# EAGLE design knitRider_T_1_4_redukce led (EAGLE 9.0.0)
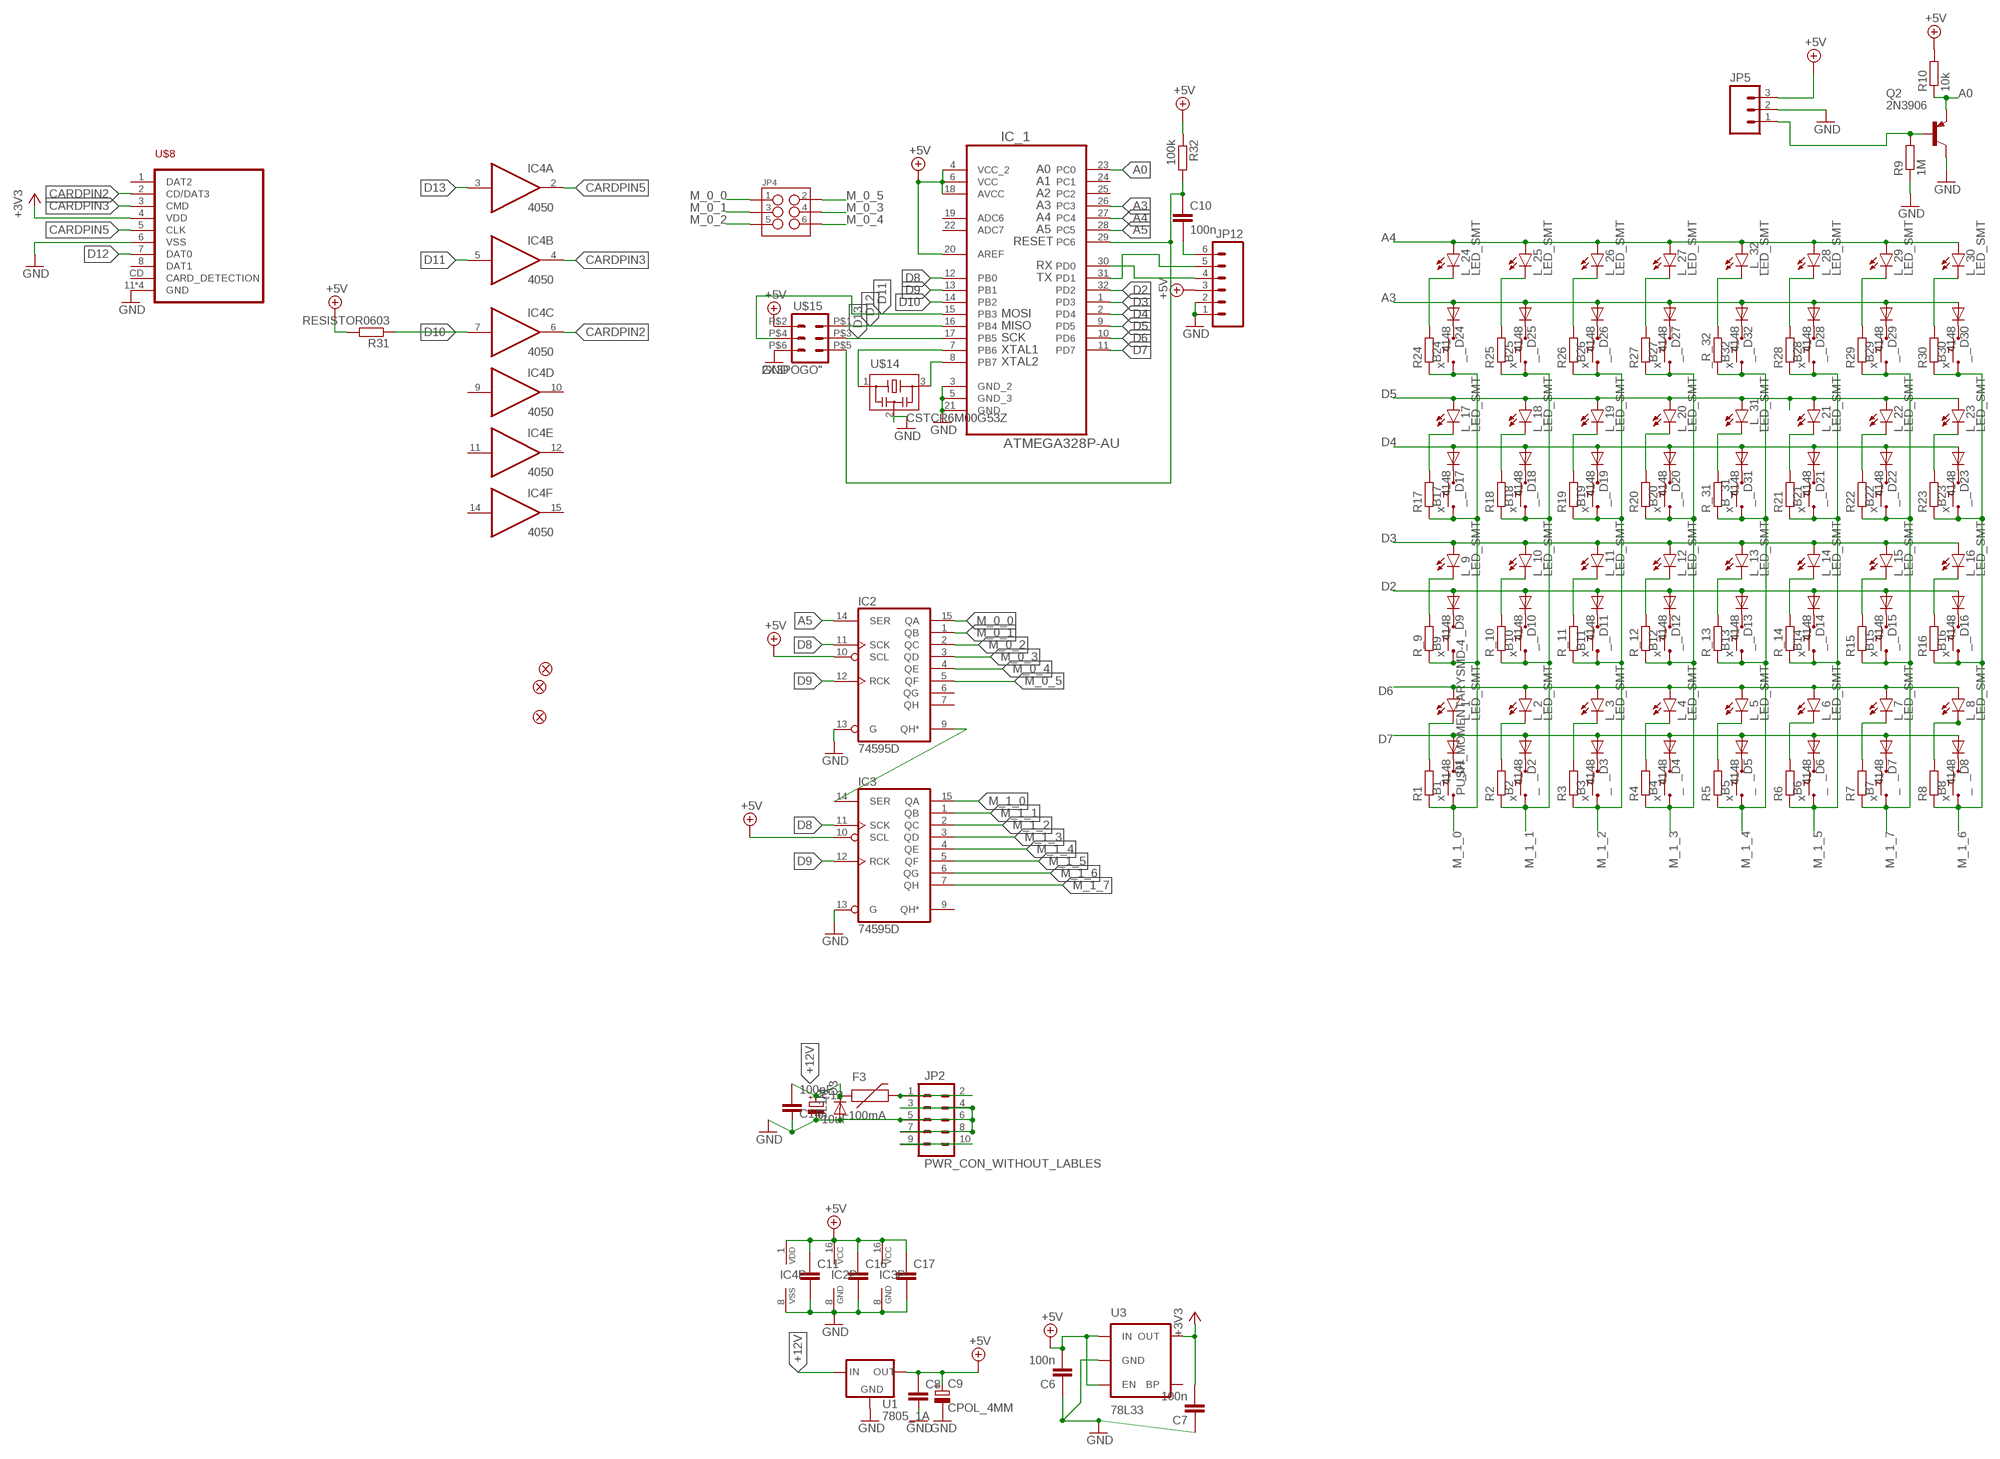
[diagram p0: schematic, sheet 1]

## Parts
_D1  4148  1N4148_0603  [DIODE_0603]
_D2  4148  1N4148_0603  [DIODE_0603]
_D3  4148  1N4148_0603  [DIODE_0603]
_D4  4148  1N4148_0603  [DIODE_0603]
_D5  4148  1N4148_0603  [DIODE_0603]
_D6  4148  1N4148_0603  [DIODE_0603]
_D7  4148  1N4148_0603  [DIODE_0603]
_D8  4148  1N4148_0603  [DIODE_0603]
_D9  4148  1N4148_0603  [DIODE_0603]
_D10  4148  1N4148_0603  [DIODE_0603]
_D11  4148  1N4148_0603  [DIODE_0603]
_D12  4148  1N4148_0603  [DIODE_0603]
_D13  4148  1N4148_0603  [DIODE_0603]
_D14  4148  1N4148_0603  [DIODE_0603]
_D15  4148  1N4148_0603  [DIODE_0603]
_D16  4148  1N4148_0603  [DIODE_0603]
_D17  4148  1N4148_0603  [DIODE_0603]
_D18  4148  1N4148_0603  [DIODE_0603]
_D19  4148  1N4148_0603  [DIODE_0603]
_D20  4148  1N4148_0603  [DIODE_0603]
_D21  4148  1N4148_0603  [DIODE_0603]
_D22  4148  1N4148_0603  [DIODE_0603]
_D23  4148  1N4148_0603  [DIODE_0603]
_D24  4148  1N4148_0603  [DIODE_0603]
_D25  4148  1N4148_0603  [DIODE_0603]
_D26  4148  1N4148_0603  [DIODE_0603]
_D27  4148  1N4148_0603  [DIODE_0603]
_D28  4148  1N4148_0603  [DIODE_0603]
_D29  4148  1N4148_0603  [DIODE_0603]
_D30  4148  1N4148_0603  [DIODE_0603]
_D31  4148  1N4148_0603  [DIODE_0603]
_D32  4148  1N4148_0603  [DIODE_0603]
_L_31  LED_SMT  [LED_0603]
_L_32  LED_SMT  [LED_0603]
_R_32  x  RESISTOR0603  [RESISTOR0603]
B1  PUSH_MOMENTARYSMD-4  [TACTILE_SWITCH_TALL]
B2  _  PUSH_MOMENTARYSMD-4  [TACTILE_SWITCH_TALL]
B3  _  PUSH_MOMENTARYSMD-4  [TACTILE_SWITCH_TALL]
B4  _  PUSH_MOMENTARYSMD-4  [TACTILE_SWITCH_TALL]
B5  _  PUSH_MOMENTARYSMD-4  [TACTILE_SWITCH_TALL]
B6  _  PUSH_MOMENTARYSMD-4  [TACTILE_SWITCH_TALL]
B7  _  PUSH_MOMENTARYSMD-4  [TACTILE_SWITCH_TALL]
B8  _  PUSH_MOMENTARYSMD-4  [TACTILE_SWITCH_TALL]
B9  _  PUSH_MOMENTARYSMD-4  [TACTILE_SWITCH_TALL]
B10  _  PUSH_MOMENTARYSMD-4  [TACTILE_SWITCH_TALL]
B11  _  PUSH_MOMENTARYSMD-4  [TACTILE_SWITCH_TALL]
B12  _  PUSH_MOMENTARYSMD-4  [TACTILE_SWITCH_TALL]
B13  _  PUSH_MOMENTARYSMD-4  [TACTILE_SWITCH_TALL]
B14  _  PUSH_MOMENTARYSMD-4  [TACTILE_SWITCH_TALL]
B15  _  PUSH_MOMENTARYSMD-4  [TACTILE_SWITCH_TALL]
B16  _  PUSH_MOMENTARYSMD-4  [TACTILE_SWITCH_TALL]
B17  _  PUSH_MOMENTARYSMD-4  [TACTILE_SWITCH_TALL]
B18  _  PUSH_MOMENTARYSMD-4  [TACTILE_SWITCH_TALL]
B19  _  PUSH_MOMENTARYSMD-4  [TACTILE_SWITCH_TALL]
B20  _  PUSH_MOMENTARYSMD-4  [TACTILE_SWITCH_TALL]
B21  _  PUSH_MOMENTARYSMD-4  [TACTILE_SWITCH_TALL]
B22  _  PUSH_MOMENTARYSMD-4  [TACTILE_SWITCH_TALL]
B23  _  PUSH_MOMENTARYSMD-4  [TACTILE_SWITCH_TALL]
B24  _  PUSH_MOMENTARYSMD-4  [TACTILE_SWITCH_TALL]
B25  _  PUSH_MOMENTARYSMD-4  [TACTILE_SWITCH_TALL]
B26  _  PUSH_MOMENTARYSMD-4  [TACTILE_SWITCH_TALL]
B27  _  PUSH_MOMENTARYSMD-4  [TACTILE_SWITCH_TALL]
B28  _  PUSH_MOMENTARYSMD-4  [TACTILE_SWITCH_TALL]
B29  _  PUSH_MOMENTARYSMD-4  [TACTILE_SWITCH_TALL]
B30  _  PUSH_MOMENTARYSMD-4  [TACTILE_SWITCH_TALL]
B32  _  PUSH_MOMENTARYSMD-4  [TACTILE_SWITCH_TALL]
B_31  _  PUSH_MOMENTARYSMD-4  [TACTILE_SWITCH_TALL]
C6  100n  CAPACITOR0603  [CAPACITOR0603]
C7  100n  CAPACITOR0603  [CAPACITOR0603]
C8  CAPACITOR0603  [CAPACITOR0603]
C9  CPOL_4MM  [CPOL_4MM]
C10  100n  CAPACITOR0603  [CAPACITOR0603]
C11  CAPACITOR0603  [CAPACITOR0603]
C12  10uF  CPOL_4MM  [CPOL_4MM]
C14  100nF  CAPACITOR0603  [CAPACITOR0603]
C16  CAPACITOR0603  [CAPACITOR0603]
C17  CAPACITOR0603  [CAPACITOR0603]
D3  SL1M  [SOD123]
F3  100mA  PTC_0805  [PTC0805]
FID1  FIDUCIAL  [FIDUCIAL]
FID2  FIDUCIAL  [FIDUCIAL]
FID3  FIDUCIAL  [FIDUCIAL]
IC2  74595D  [SO16]
IC3  74595D  [SO16]
IC4  4050  [SO16]
IC_1  ATMEGA328P-AU  [TQFP32]
JP2  PWR_CON_WITHOUT_LABLES  [PWR_CON_WITHOUT_LABLES]
JP4  M03X2NO_SILK  [2X3-NS]
JP5  M03LOCK  [1X03_LOCK]
JP12  M06LOCK  [1X06_LOCK]
L_1  LED_SMT  [LED_0603]
L_2  LED_SMT  [LED_0603]
L_3  LED_SMT  [LED_0603]
L_4  LED_SMT  [LED_0603]
L_5  LED_SMT  [LED_0603]
L_6  LED_SMT  [LED_0603]
L_7  LED_SMT  [LED_0603]
L_8  LED_SMT  [LED_0603]
L_9  LED_SMT  [LED_0603]
L_10  LED_SMT  [LED_0603]
L_11  LED_SMT  [LED_0603]
L_12  LED_SMT  [LED_0603]
L_13  LED_SMT  [LED_0603]
L_14  LED_SMT  [LED_0603]
L_15  LED_SMT  [LED_0603]
L_16  LED_SMT  [LED_0603]
L_17  LED_SMT  [LED_0603]
L_18  LED_SMT  [LED_0603]
L_19  LED_SMT  [LED_0603]
L_20  LED_SMT  [LED_0603]
L_21  LED_SMT  [LED_0603]
L_22  LED_SMT  [LED_0603]
L_23  LED_SMT  [LED_0603]
L_24  LED_SMT  [LED_0603]
L_25  LED_SMT  [LED_0603]
L_26  LED_SMT  [LED_0603]
L_27  LED_SMT  [LED_0603]
L_28  LED_SMT  [LED_0603]
L_29  LED_SMT  [LED_0603]
L_30  LED_SMT  [LED_0603]
Q2  2N3906  [SOT23]
R1  x  RESISTOR0603  [RESISTOR0603]
R2  x  RESISTOR0603  [RESISTOR0603]
R3  x  RESISTOR0603  [RESISTOR0603]
R4  x  RESISTOR0603  [RESISTOR0603]
R5  x  RESISTOR0603  [RESISTOR0603]
R6  x  RESISTOR0603  [RESISTOR0603]
R7  x  RESISTOR0603  [RESISTOR0603]
R8  x  RESISTOR0603  [RESISTOR0603]
R9  1M  RESISTOR0603  [RESISTOR0603]
R10  10k  RESISTOR0603  [RESISTOR0603]
R15  x  RESISTOR0603  [RESISTOR0603]
R16  x  RESISTOR0603  [RESISTOR0603]
R17  x  RESISTOR0603  [RESISTOR0603]
R18  x  RESISTOR0603  [RESISTOR0603]
R19  x  RESISTOR0603  [RESISTOR0603]
R20  x  RESISTOR0603  [RESISTOR0603]
R21  x  RESISTOR0603  [RESISTOR0603]
R22  x  RESISTOR0603  [RESISTOR0603]
R23  x  RESISTOR0603  [RESISTOR0603]
R24  x  RESISTOR0603  [RESISTOR0603]
R25  x  RESISTOR0603  [RESISTOR0603]
R26  x  RESISTOR0603  [RESISTOR0603]
R27  x  RESISTOR0603  [RESISTOR0603]
R28  x  RESISTOR0603  [RESISTOR0603]
R29  x  RESISTOR0603  [RESISTOR0603]
R30  x  RESISTOR0603  [RESISTOR0603]
R31  RESISTOR0603  [RESISTOR0603]
R32  100k  RESISTOR0603  [RESISTOR0603]
R_9  x  RESISTOR0603  [RESISTOR0603]
R_10  x  RESISTOR0603  [RESISTOR0603]
R_11  x  RESISTOR0603  [RESISTOR0603]
R_12  x  RESISTOR0603  [RESISTOR0603]
R_13  x  RESISTOR0603  [RESISTOR0603]
R_14  x  RESISTOR0603  [RESISTOR0603]
R_31  x  RESISTOR0603  [RESISTOR0603]
U1  7805_1A  [DPAK]
U3  78L33  V_REG_LDOSMD  [SOT23-5]
U$8  SD_CARD_SLOT  [MICRO_SD_CARD_SLOT]
U$14  CSTCR6M00G53Z  [CSTCR6M]
U$15  2X3POGO"  [2X3_POGO]

## Nets
+3V3: C7.2 U3.5(OUT) U$8.4(VDD)
+5V: C6.2 C8.1 C9.+ C11.1 C16.1 C17.1 IC2.10(SCL) IC2.16(VCC) IC3.10(SCL) IC3.16(VCC) IC4.1(P:VDD) IC_1.4(VCC_2) IC_1.6(VCC) IC_1.18(AVCC) IC_1.20(AREF) JP5.3 JP12.3 R10.2 R31.2 R32.1 U1.3(OUT) U3.1(IN) U3.3(EN) U$15.P$2
+12V: C12.+ C14.2 D3.C F3.2 U1.1(IN)
_L32: _L_32.K(C) _R_32.2
A0: IC_1.23(PC0) Q2.E R10.1
A3: _D24.A _D25.A _D26.A _D27.A _D28.A _D29.A _D30.A _D32.A IC_1.26(PC3)
A4: _L_32.A IC_1.27(PC4) L_24.A L_25.A L_26.A L_27.A L_28.A L_29.A L_30.A
A5: IC2.14(SER) IC_1.28(PC5)
CARDPIN2: IC4.6(C:O) U$8.2(CD/DAT3)
CARDPIN3: IC4.4(B:O) U$8.3(CMD)
CARDPIN5: IC4.2(A:O) U$8.5(CLK)
D2: _D9.A _D10.A _D11.A _D12.A _D13.A _D14.A _D15.A _D16.A IC_1.32(PD2)
D3: IC_1.1(PD3) L_9.A L_10.A L_11.A L_12.A L_13.A L_14.A L_15.A L_16.A
D4: _D17.A _D18.A _D19.A _D20.A _D21.A _D22.A _D23.A _D31.A IC_1.2(PD4)
D5: _L_31.A IC_1.9(PD5) L_17.A L_18.A L_19.A L_20.A L_21.A L_22.A L_23.A
D6: IC_1.10(PD6) L_1.A L_2.A L_3.A L_4.A L_5.A L_6.A L_7.A L_8.A
D7: _D1.A _D2.A _D3.A _D4.A _D5.A _D6.A _D7.A _D8.A IC_1.11(PD7)
D8: IC2.11(SCK) IC3.11(SCK) IC_1.12(PB0)
D9: IC2.12(RCK) IC3.12(RCK) IC_1.13(PB1)
D10: IC4.7(C:I) IC_1.14(PB2) R31.1
D11: IC4.5(B:I) IC_1.15(PB3) U$15.P$4
D12: IC_1.16(PB4) U$8.7(DAT0) U$15.P$1
D13: IC4.3(A:I) IC_1.17(PB5) U$15.P$3
GND: C6.1 C7.1 C8.2 C9.- C11.2 C12.- C14.1 C16.2 C17.2 D3.A IC2.8(GND) IC2.13(G) IC3.8(GND) IC3.13(G) IC4.8(P:VSS) IC_1.3(GND_2) IC_1.5(GND_3) IC_1.21(GND) JP2.3 JP2.4 JP2.5 JP2.6 JP2.7 JP2.8 JP5.2 JP12.1 JP12.2 Q2.C R9.1 U1.4(GND) U3.2(GND) U$8.6(VSS) U$8.11(GND) U$8.12(GND) U$8.13(GND) U$8.G(GND) U$14.2 U$15.P$6
L32: _L_31.K(C) R_31.2
M_0_0: IC2.15(QA) JP4.1
M_0_1: IC2.1(QB) JP4.3
M_0_2: IC2.2(QC) JP4.5
M_0_3: IC2.3(QD) JP4.4
M_0_4: IC2.4(QE) JP4.6
M_0_5: IC2.5(QF) JP4.2
M_1_0: B1.A1 B1.A2 B9.A1 B9.A2 B17.A1 B17.A2 B24.A1 B24.A2 IC3.15(QA) R1.1 R17.1 R24.1 R_9.1
M_1_1: B2.A1 B2.A2 B10.A1 B10.A2 B18.A1 B18.A2 B25.A1 B25.A2 IC3.1(QB) R2.1 R18.1 R25.1 R_10.1
M_1_2: B3.A1 B3.A2 B11.A1 B11.A2 B19.A1 B19.A2 B26.A1 B26.A2 IC3.2(QC) R3.1 R19.1 R26.1 R_11.1
M_1_3: B4.A1 B4.A2 B12.A1 B12.A2 B20.A1 B20.A2 B27.A1 B27.A2 IC3.3(QD) R4.1 R20.1 R27.1 R_12.1
M_1_4: _R_32.1 B5.A1 B5.A2 B13.A1 B13.A2 B32.A1 B32.A2 B_31.A1 B_31.A2 IC3.4(QE) R5.1 R_13.1 R_31.1
M_1_5: B6.A1 B6.A2 B14.A1 B14.A2 B21.A1 B21.A2 B28.A1 B28.A2 IC3.5(QF) R6.1 R21.1 R28.1 R_14.1
M_1_6: B8.A1 B8.A2 B16.A1 B16.A2 B23.A1 B23.A2 B30.A1 B30.A2 IC3.6(QG) R8.1 R16.1 R23.1 R30.1
M_1_7: B7.A1 B7.A2 B15.A1 B15.A2 B22.A1 B22.A2 B29.A1 B29.A2 IC3.7(QH) R7.1 R15.1 R22.1 R29.1
N$1: _D1.K(C) B1.B1 B1.B2
N$2: _D2.K(C) B2.B1 B2.B2
N$3: _D3.K(C) B3.B1 B3.B2
N$4: JP5.1 Q2.B R9.2
N$5: _D4.K(C) B4.B1 B4.B2
N$8: _D5.K(C) B5.B1 B5.B2
N$9: _D6.K(C) B6.B1 B6.B2
N$10: L_3.K(C) R3.2
N$11: F3.3 JP2.1 JP2.2
N$12: _D9.K(C) B9.B1 B9.B2
N$13: _D10.K(C) B10.B1 B10.B2
N$14: _D7.K(C) B7.B1 B7.B2
N$15: _D8.K(C) B8.B1 B8.B2
N$16: JP2.9 JP2.10
N$17: _D11.K(C) B11.B1 B11.B2
N$21: L_4.K(C) R4.2
N$22: L_5.K(C) R5.2
N$23: L_6.K(C) R6.2
N$24: L_7.K(C) R7.2
N$25: _D12.K(C) B12.B1 B12.B2
N$26: L_8.K(C) R8.2
N$27: _D13.K(C) B13.B1 B13.B2
N$28: _D14.K(C) B14.B1 B14.B2
N$29: _D15.K(C) B15.B1 B15.B2
N$30: _D16.K(C) B16.B1 B16.B2
N$31: _D17.K(C) B17.B1 B17.B2
N$32: _D18.K(C) B18.B1 B18.B2
N$33: _D19.K(C) B19.B1 B19.B2
N$35: L_1.K(C) R1.2
N$36: L_2.K(C) R2.2
N$37: _D20.K(C) B20.B1 B20.B2
N$38: _D21.K(C) B21.B1 B21.B2
N$39: _D22.K(C) B22.B1 B22.B2
N$40: _D23.K(C) B23.B1 B23.B2
N$41: _D24.K(C) B24.B1 B24.B2
N$42: L_9.K(C) R_9.2
N$43: L_10.K(C) R_10.2
N$44: L_11.K(C) R_11.2
N$45: L_12.K(C) R_12.2
N$46: L_13.K(C) R_13.2
N$47: L_14.K(C) R_14.2
N$48: L_15.K(C) R15.2
N$51: L_16.K(C) R16.2
N$53: _D25.K(C) B25.B1 B25.B2
N$55: _D26.K(C) B26.B1 B26.B2
N$59: L_18.K(C) R18.2
N$60: L_19.K(C) R19.2
N$61: L_17.K(C) R17.2
N$62: L_20.K(C) R20.2
N$63: L_23.K(C) R23.2
N$64: L_22.K(C) R22.2
N$65: _D27.K(C) B27.B1 B27.B2
N$66: L_21.K(C) R21.2
N$68: _D28.K(C) B28.B1 B28.B2
N$69: _D29.K(C) B29.B1 B29.B2
N$70: _D30.K(C) B30.B1 B30.B2
N$71: _D31.K(C) B_31.B1 B_31.B2
N$72: _D32.K(C) B32.B1 B32.B2
N$80: IC2.9(QH*) IC3.14(SER)
N$82: L_24.K(C) R24.2
N$83: L_25.K(C) R25.2
N$84: L_26.K(C) R26.2
N$85: L_27.K(C) R27.2
N$86: L_28.K(C) R28.2
N$87: L_29.K(C) R29.2
N$88: L_30.K(C) R30.2
N$94: IC_1.7(PB6) U$14.1
N$95: IC_1.8(PB7) U$14.3
N$96: IC_1.30(PD0) JP12.4
N$97: IC_1.31(PD1) JP12.5
N$98: C10.1 IC_1.29(PC6) R32.2 U$15.P$5
N$99: C10.2 JP12.6
Unconnected: IC2.6(QG) IC2.7(QH) IC3.9(QH*) IC4.9(D:I) IC4.10(D:O) IC4.11(E:I) IC4.12(E:O) IC4.14(F:I) IC4.15(F:O) IC_1.19(ADC6) IC_1.22(ADC7) IC_1.24(PC1) IC_1.25(PC2) U3.4(BP) U$8.1(DAT2) U$8.8(DAT1) U$8.CD(CARD_DETECTION)

## Library data of the parts
_D1-_D32 = BASTL_DIODES:1N4148_0603; ASSEMBLED: yes; TYPE: SMT
_L_31 _L_32 L_1-L_30 = BASTL_LEDS:LED_SMT; ASSEMBLED: yes; TYPE: SMT
_R_32 R1-R10 R15-R32 R_9-R_14 R_31 = BASTL_RESISTORS:RESISTOR0603; ASSEMBLED: yes; TYPE: SMT
B1-B30 B32 B_31 = BASTL_SWITCHES:PUSH_MOMENTARY: Various NO switches- pushbuttons, reed, etc; ASSEMBLED: yes; PROD_ID: SWCH-11966; TYPE: SMT
C6-C8 C10 C11 C14 C16 C17 = BASTL_CAPACITORS:CAPACITOR0603; ASSEMBLED: yes; TYPE: SMT
C9 C12 = BASTL_CAPACITORS:CPOL_4MM; ASSEMBLED: yes; TYPE: SMT
D3 = BASTL_DIODES:SL1M: diode instead of 1N4007; ASSEMBLED: yes; MAN: DIOTEC SEMICONDUCTOR; MPN: SL1M; TYPE: SMT
F3 = BASTL_FUSES:PTC_0805
FID1-FID3 = BASTL_FIDUCIALS:FIDUCIAL; ASSEMBLED: no; TYPE: FID
IC2 IC3 = BASTL_ICS:74*595: 8-bit SHIFT REGISTER, output latch; ASSEMBLED: yes; MAN: Texas Instruments; MPN: SN74HC595DR; TYPE: SMT
IC4 = BASTL_ICS:4050: Hex non-inverting BUFFER; ASSEMBLED: yes; MAN: Texas Instruments; MPN: CD4050BDR; TYPE: SMT
IC_1 = BASTL_ICS:ATMEGA328P-AU: 8-bit Microcontroller with In-System Programmable Flash; ASSEMBLED: yes; MAN: Microchip; MPN: ATMEGA328P-AU; TYPE: SMT
JP2 = BASTL_CONNECTORS:PWR_CON_WITHOUT_LABLES; ASSEMBLED: yes; ODOO: Male 2x40; TYPE: THT
JP4 = BASTL_PINHEADERS:M03X2: 2x3 .1" header. Shrouded, with keying- CONN-10681 SMT- CONN-11415 Pogo pins- HW-11044
JP5 = BASTL_PINHEADERS:M03: Header 3 Standard 3-pin 0.1" header. Use with straight break away headers (SKU : PRT-00116), right angle break away headers (PRT-00553), swiss pins (PRT-00743), machine pins (PRT-00117), and female headers (PRT-00115). Molex polarized connector foot print use with SKU : PRT-08232 with associated crimp pins and housings.
JP12 = BASTL_PINHEADERS:M06: Header 6 Standard 6-pin 0.1" header. Use with straight break away headers (SKU : PRT-00116), right angle break away headers (PRT-00553), swiss pins (PRT-00743), machine pins (PRT-00117), and female headers (PRT-00115). Molex polarized connector foot print use with SKU : PRT-08094 with associated crimp pins and housings. NOTES ON THE VARIANTS LOCK and LOCK_LONGPADS... This footprint was designed to help hold the alignment of a through-hole component (i.e. 6-pin header) while soldering it into place. You may notice that each hole has been shifted either up or down by 0.005 of an inch from it's more standard position (which is a perfectly straight line). This slight alteration caused the pins (the squares in the middle) to touch the edges of the holes. Because they are alternating, it causes a "brace" to hold the component in place. 0.005 has proven to be the perfect amount of "off-center" position when using our standard breakaway headers. Although looks a little odd when you look at the bare footprint, once you have a header in there, the alteration is very hard to notice. Also,if you push a header all the way into place, it is covered up entirely on the bottom side. This idea of altering the position of holes to aid alignment will be further integrated into the Sparkfun Library for other footprints. It can help hold any component with 3 or more connection pins.
Q2 = BASTL_TRANZISTORS:2N3906; ASSEMBLED: yes; MAN: ON SEMICONDUCTOR; MPN: MMBT3906LT1G; TYPE: SMT
U1 = BASTL_VOLTAGE REGULATORS:7805_1A
U3 = BASTL_VOLTAGE REGULATORS:V_REG_LDO: Voltage Regulator LDO Standard 150mA LDO voltage regulator in SOT-23 layout. Micrel part MIC5205. BP (by-pass) pin is used to lower output noise with 470pF cap.
U$8 = BASTL_R&D:SD_CARD_SLOT
U$14 = BASTL_CRYSTALS, RESNATORS:CSTCR: Resonator Source: murata.co.jp tme:CSTCR6M00G53Z; MPN: CSTCR6M00G53-R0
U$15 = BASTL_CONNECTORS:2X3POGO; ASSEMBLED: no; ODOO: ISP; TYPE: THT

## Board
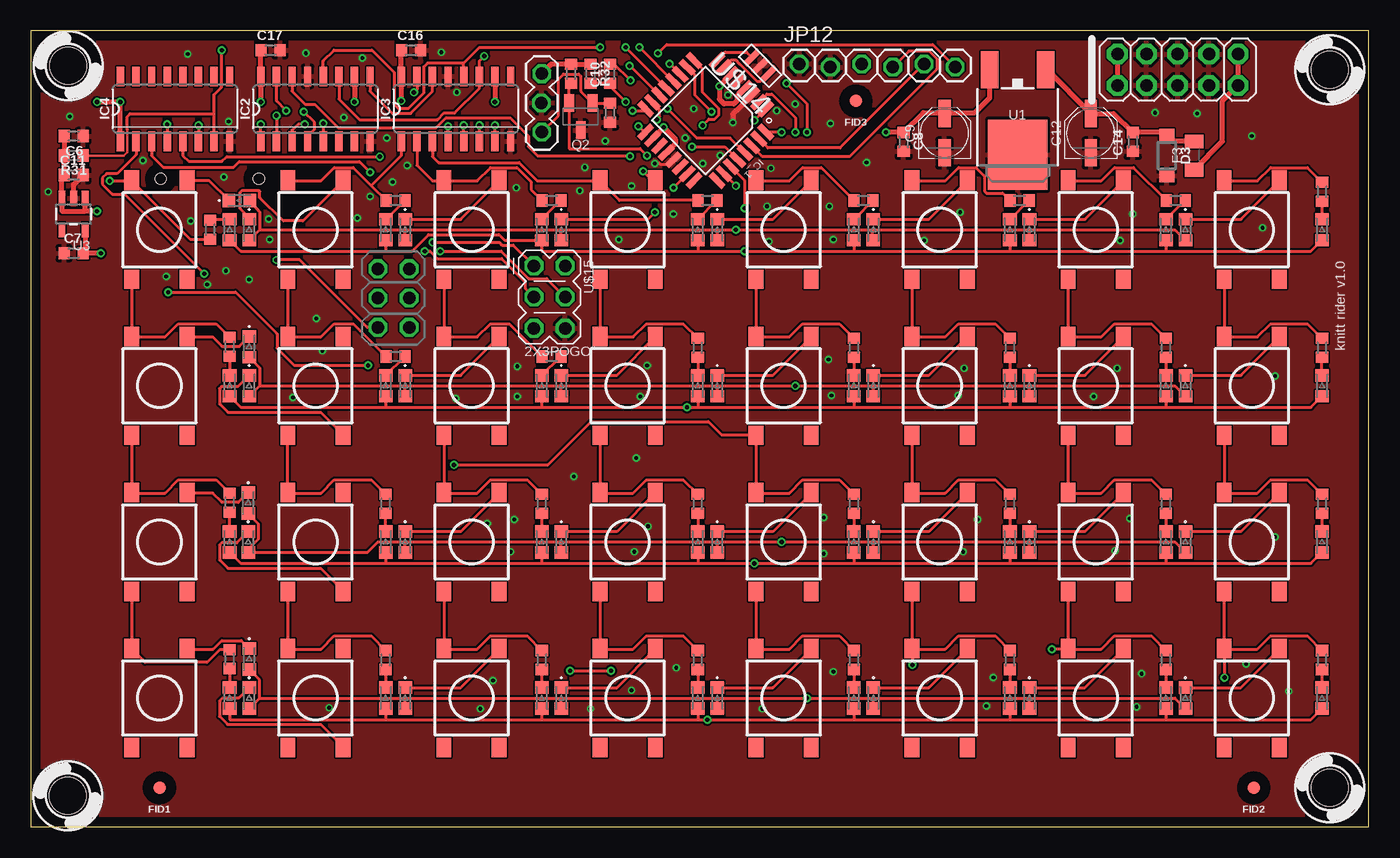
[diagram p1: board, top side]
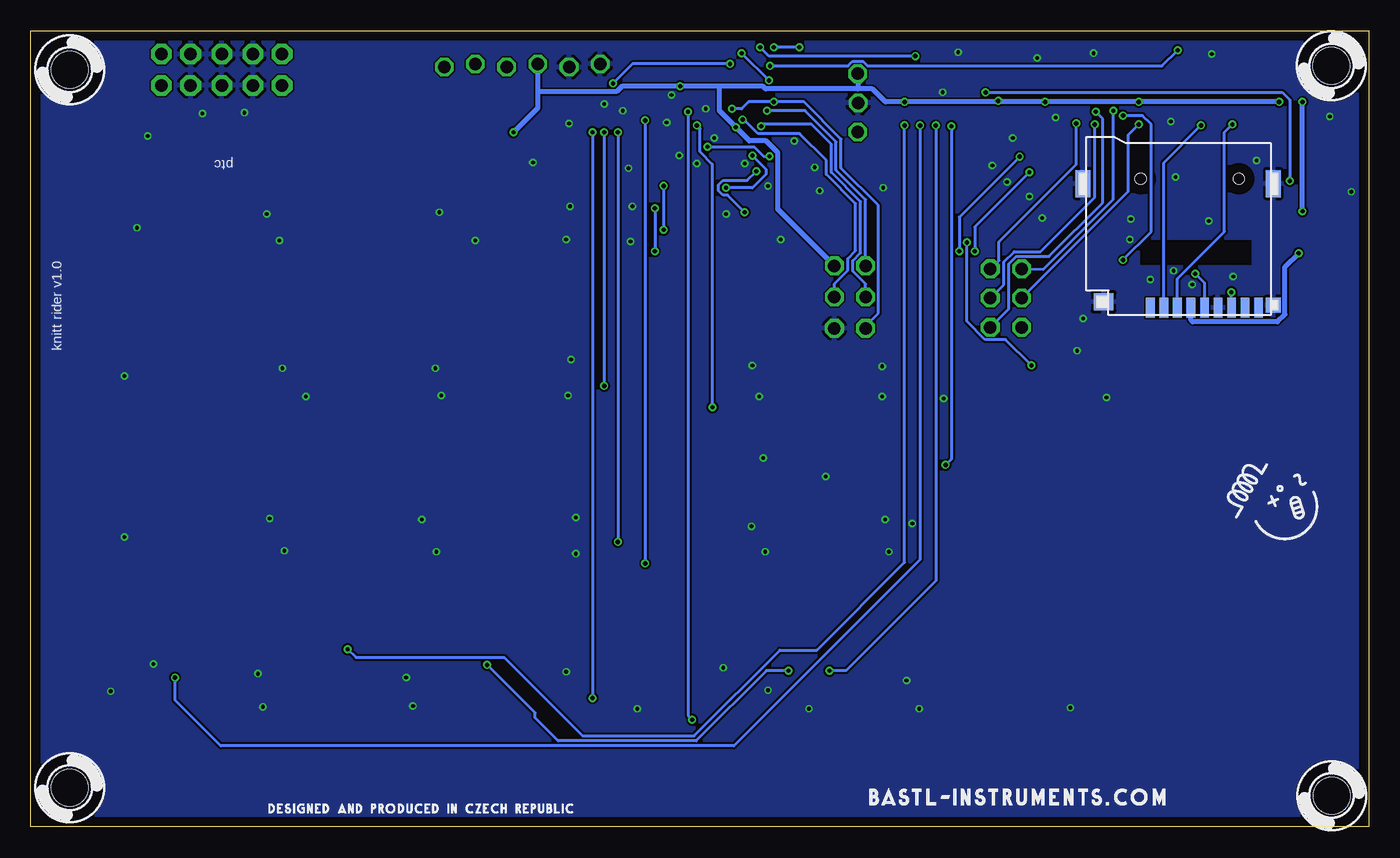
[diagram p2: board, bottom side, seen from below]

Size 108.9 x 64.77 mm. Coordinates in mm from the lower left corner, seen from the top.
Outline: 0,0 108.9,0 108.9,64.77 0,64.77 0,0
Copper layers (1*16): Top 0.035mm / dielectric 1.5mm / Bottom 0.035mm
Design rules "2 vrstvy trida 6 *": minimum track width 0.15mm, minimum drill 0.3mm, track to track 0.15mm, track to pad 0.15mm, pad to pad 0.15mm, via to via 0.15mm, smd to smd 0.15mm, copper to edge 0.8mm, drill to drill 0.3mm, minimum pad ring 0.15mm, minimum via ring 0.15mm, stop-mask expansion 0.05mm, vias tented up to drill 3mm, thermal gap 10mil

### Footprints (pad centres in the part's own frame; a part is rotated, then mirrored left to right if it is on the bottom)
DIODE_0603 = smd 1 x 1.1: A 0.85,0; K -0.85,0
LED_0603 = smd 1 x 1.1: A 0.85,0; K -0.85,0
RESISTOR0603 = smd 0.9 x 1: 1 -0.771,0; 2 0.771,0
TACTILE_SWITCH_TALL = smd 1.6 x 1.2: A1 -4.026,-2.25; B1 -4.026,2.25 | smd 1.56 x 1.2: A2 4.026,-2.25; B2 4.026,2.25
CAPACITOR0603 = smd 0.9 x 1: 1 -0.771,0; 2 0.771,0
CPOL_4MM = smd 2.2 x 1: + 1.6,0; - -1.6,0
SOD123 = smd 1.05 x 1.2: A 1.654,0; C -1.654,0
PTC0805 = smd 1.1 x 1.5: 2 1.15,0; 3 -1.15,0
FIDUCIAL = smd 1 x 1: 2 0,0
SO16 = smd 0.6 x 1.6: 1 -4.445,-2.635; 2 -3.175,-2.635; 3 -1.905,-2.635; 4 -0.635,-2.635; 5 0.635,-2.635; 6 1.905,-2.635; 7 3.175,-2.635; 8 4.445,-2.635; 9 4.445,2.635; 10 3.175,2.635; 11 1.905,2.635; 12 0.635,2.635; 13 -0.635,2.635; 14 -1.905,2.635; 15 -3.175,2.635; 16 -4.445,2.635
TQFP32 = smd 1.473 x 0.508: 1 -4.115,2.794; 2 -4.115,2.007; 3 -4.115,1.194; 4 -4.115,0.406; 5 -4.115,-0.406; 6 -4.115,-1.194; 7 -4.115,-2.007; 8 -4.115,-2.794; 17 4.115,-2.794; 18 4.115,-2.007; 19 4.115,-1.194; 20 4.115,-0.406; 21 4.115,0.406; 22 4.115,1.194; 23 4.115,2.007; 24 4.115,2.794 | smd 0.508 x 1.473: 9 -2.794,-4.115; 10 -2.007,-4.115; 11 -1.194,-4.115; 12 -0.406,-4.115; 13 0.406,-4.115; 14 1.194,-4.115; 15 2.007,-4.115; 16 2.794,-4.115; 25 2.794,4.115; 26 2.007,4.115; 27 1.194,4.115; 28 0.406,4.115; 29 -0.406,4.115; 30 -1.194,4.115; 31 -2.007,4.115; 32 -2.794,4.115
PWR_CON_WITHOUT_LABLES = drill 1.016 pad 1.676 octagon: 1 -1.27,4.904; 2 1.27,4.904; 3 -1.27,2.54; 4 1.27,2.54; 5 -1.27,0; 6 1.27,0; 7 -1.27,-2.54; 8 1.27,-2.54; 9 -1.27,-4.904; 10 1.27,-4.904
2X3-NS = drill 1.016 pad 1.524 octagon: 1 -2.381,-1.27; 2 -2.381,1.27; 3 0,-1.27; 4 0,1.27; 5 2.381,-1.27; 6 2.381,1.27
1X03_LOCK = drill 1.016 octagon: 1 0.167,0; 2 2.54,0.032; 3 4.921,0
1X06_LOCK = drill 1.016 octagon: 1 0,0; 2 2.54,-0.254; 3 5.08,0; 4 7.62,-0.254; 5 10.16,0; 6 12.7,-0.254
SOT23 = smd 0.8 x 1.4: B -0.95,-1.1; C 0,1.1; E 0.95,-1.1
DPAK = smd 1.4 x 3: 1 -2.28,-4.04; 3 2.28,-4.04 | smd 4.826 x 5.715: 4 0,2.858
SOT23-5 = smd 0.55 x 1.2: 1 -0.95,-1.3; 2 0,-1.3; 3 0.95,-1.3; 4 0.95,1.3; 5 -0.95,1.3
3MM_HOLE = hole 3: 0,0
MICRO_SD_CARD_SLOT = smd 0.7 x 1.6: 1 0,0; 2 -1.1,0; 3 -2.2,0; 4 -3.3,0; 5 -4.4,0; 6 -5.5,0; 7 -6.6,0; 8 -7.7,0; CD -8.8,0 | smd 1.6 x 1.4: 11 3.8,-0.5 | smd 1.2 x 2.2: 12 -10,-10.1; 13 5.5,-10.1 | smd 1.2 x 1.2: G -10,-0.2 | hole 0.9: -7.2,-10.5; 0.8,-10.5
CSTCR6M = smd 0.5 x 1.6: 1 -0.95,0; 2 0,0; 3 0.95,0
2X3_POGO = drill 1.016 pad 1.524 octagon: P$1 0,0; P$2 0,2.54; P$3 2.54,0; P$4 2.54,2.54; P$5 5.08,0; P$6 5.08,2.54

### Placement (x,y rotation side)
_D1  17.78,13.65 270 top
_D2  17.78,10.48 270 top
_D3  30.48,10.48 270 top
_D4  43.18,10.48 270 top
_D5  55.88,10.48 270 top
_D6  68.58,10.48 270 top
_D7  81.28,10.48 270 top
_D8  93.98,10.48 270 top
_D9  17.7,26.35 270 top
_D10  17.7,23.18 270 top
_D11  30.48,23.18 270 top
_D12  43.18,23.18 270 top
_D13  55.88,23.18 270 top
_D14  68.58,23.18 270 top
_D15  81.28,23.18 270 top
_D16  93.98,23.18 270 top
_D17  17.78,39.05 270 top
_D18  17.78,35.88 270 top
_D19  30.48,35.88 270 top
_D20  43.18,35.88 270 top
_D21  68.58,35.88 270 top
_D22  81.28,35.88 270 top
_D23  93.98,35.88 270 top
_D24  16.99,50.96 0 top
_D25  17.78,48.58 270 top
_D26  30.48,48.58 270 top
_D27  43.18,48.58 270 top
_D28  68.58,48.58 270 top
_D29  81.28,48.58 270 top
_D30  93.98,48.58 270 top
_D31  55.88,35.88 270 top
_D32  55.88,48.58 270 top
_L_31  66.99,35.88 270 top
_L_32  66.99,48.58 270 top
_R_32  67.79,50.96 0 top
B1  10.48,10.48 270 top
B2  23.18,10.48 270 top
B3  35.88,10.48 270 top
B4  48.58,10.48 270 top
B5  61.28,10.48 270 top
B6  73.98,10.48 270 top
B7  86.68,10.48 270 top
B8  99.38,10.48 270 top
B9  10.48,23.18 270 top
B10  23.18,23.18 270 top
B11  35.88,23.18 270 top
B12  48.58,23.18 270 top
B13  61.28,23.18 270 top
B14  73.98,23.18 270 top
B15  86.68,23.18 270 top
B16  99.38,23.18 270 top
B17  10.48,35.88 270 top
B18  23.18,35.88 270 top
B19  35.88,35.88 270 top
B20  48.58,35.88 270 top
B21  73.98,35.88 270 top
B22  86.68,35.88 270 top
B23  99.38,35.88 270 top
B24  10.48,48.58 270 top
B25  23.18,48.58 270 top
B26  35.88,48.58 270 top
B27  48.58,48.58 270 top
B28  73.98,48.58 270 top
B29  86.68,48.58 270 top
B30  99.38,48.58 270 top
B32  61.28,48.58 270 top
B_31  61.28,35.88 270 top
C6  3.49,56.2 180 top
C7  3.49,46.67 0 top
C8  71.04,55.72 270 top
C9  74.37,56.44 90 top
C10  47.15,61.28 90 top
C11  3.49,53.02 0 top
C12  86.28,56.44 90 top
C14  89.69,55.72 90 top
C16  30.96,63.18 0 top
C17  19.53,63.18 0 top
D3  92.47,54.61 270 top
F3  94.69,54.61 90 top
FID1  10.48,3.17 0 top
FID2  99.54,3.17 0 top
FID3  67.15,59.05 0 top
IC2  23.18,58.42 0 top
IC3  34.61,58.42 0 top
IC4  11.75,58.42 0 top
IC_1  54.93,57.47 225 top
JP2  93.34,61.59 270 top
JP4  29.53,43.02 270 top
JP5  41.59,56.36 90 top
JP12  62.55,62.07 0 top
L_1  16.19,10.48 270 top
L_2  28.89,10.48 270 top
L_3  41.59,10.48 270 top
L_4  54.29,10.48 270 top
L_5  66.99,10.48 270 top
L_6  79.69,10.48 270 top
L_7  92.39,10.48 270 top
L_8  105.09,10.48 270 top
L_9  16.19,23.18 270 top
L_10  28.89,23.18 270 top
L_11  41.59,23.18 270 top
L_12  54.29,23.18 270 top
L_13  66.99,23.18 270 top
L_14  79.69,23.18 270 top
L_15  92.39,23.18 270 top
L_16  105.09,23.18 270 top
L_17  16.19,35.88 270 top
L_18  28.89,35.88 270 top
L_19  41.59,35.88 270 top
L_20  54.29,35.88 270 top
L_21  79.69,35.88 270 top
L_22  92.39,35.88 270 top
L_23  105.09,35.88 270 top
L_24  16.19,48.58 270 top
L_25  28.89,48.58 270 top
L_26  41.59,48.58 270 top
L_27  54.29,48.58 270 top
L_28  79.69,48.58 270 top
L_29  92.39,48.58 270 top
L_30  105.09,48.58 270 top
Q2  44.77,57.78 180 top
R1  16.19,13.65 270 top
R2  28.89,13.57 270 top
R3  41.59,13.57 270 top
R4  54.29,13.57 270 top
R5  66.99,13.57 270 top
R6  79.69,13.57 270 top
R7  92.39,13.57 270 top
R8  105.09,13.57 270 top
R9  47.15,58.1 90 top
R10  43.97,61.28 90 top
R15  92.39,26.27 270 top
R16  105.09,26.27 270 top
R17  16.19,39.05 270 top
R18  29.69,38.26 0 top
R19  42.39,38.26 0 top
R20  54.29,38.97 270 top
R21  79.69,38.97 270 top
R22  92.39,38.97 270 top
R23  105.09,38.97 270 top
R24  14.61,48.58 90 top
R25  29.69,50.96 0 top
R26  42.39,50.96 0 top
R27  55.09,50.96 0 top
R28  80.49,50.96 0 top
R29  93.19,50.96 0 top
R30  105.09,51.67 270 top
R31  3.49,54.61 180 top
R32  45.56,61.28 270 top
R_9  16.19,26.35 270 top
R_10  28.89,26.27 270 top
R_11  41.59,26.27 270 top
R_12  54.29,26.27 270 top
R_13  66.99,26.27 270 top
R_14  79.69,26.27 270 top
R_31  66.99,38.97 270 top
U1  80.33,57.55 180 top
U3  3.49,49.85 180 top
U$1  [BASTL_WEB_2]  40.64,1.75 0 bottom
U$2  [3MM_HOLE]  3.04,61.91 0 top
U$3  [3MM_HOLE]  3.02,2.54 0 top
U$4  [3MM_HOLE]  105.73,3.17 0 top
U$5  [3MM_HOLE]  105.73,61.59 0 top
U$6  [DES_PROD]  89.53,0.95 0 bottom
U$8  17.78,42.23 180 bottom
U$11  [BASTL_HLAVA_1]  4.13,23.34 90 bottom
U$14  59.37,61.91 135 top
U$15  40.96,45.64 270 top

### Tracks (layer width: path | path; a pad name or v marks a point on that pad's centre or on a via)
+3V3  (via drill 0.35)
  Top 0.406: U3.5 4.44,46.85 C7.2 v5.72,46.67
  Bottom 0.406: v5.72,46.67 6.83,45.56 6.83,41.68 7.43,41.07 14.32,41.07 14.48,41.23 U$8.4
+5V  (via drill 0.35)
  Top 0.406: R32.1 R10.2 42.36,62.05 JP5.3 | C6.2 R31.2 C11.1 2.54,52.84 U3.3 2.54,50.09 4.45,50.09 | C9.+ 74.44,58.1 | 74.44,58.1 76.83,58.1 78.05,59.31 U1.3 | C17.1 18.73,63.16 IC2.16 v18.73,58.98 | C16.1 30.16,63.16 IC3.16 v30.16,59.05 | 4.45,50.09 U3.1 | v5.4,50.09 4.45,50.09 | 74.44,58.1 72.65,58.1 C8.1 69.64,56.49 v69.61,56.52 | v5.4,58.98 v7.3,58.98 IC4.1 | IC_1.6 56.99,61.2 v56.04,60.25 56.04,59.21 56.44,58.82 57.23,58.82 57.47,59.05 57.47,59.43 IC_1.4 | IC2.10 v26.35,58.98 | IC3.10 v37.78,58.98 | IC_1.18 51.51,56.89 v51.51,56.91 52.47,55.96 52.47,55.56 52.45,55.56 IC_1.20
  Bottom 0.406: v69.61,56.52 67.63,58.5 67.63,59.85 | 67.63,59.85 JP12.3 | v5.4,50.09 v5.4,58.98 | v7.3,58.98 v18.73,58.98 v26.35,58.98 30.16,58.98 | 30.16,58.98 v37.78,58.98 39.33,58.98 40.4,60.04 41.59,60.04 | 52.86,60.25 49.3,60.25 49.1,60.04 41.59,60.04 | 52.86,60.25 v56.04,60.25 60.79,60.25 61.23,59.81 67.58,59.81 67.63,59.85 | v30.16,59.05 30.16,58.98 | U$15.P$2 48.09,50.24 48.09,54.84 49.06,55.8 50.41,55.8 v51.51,56.91 52.86,58.26 52.86,60.25 | JP5.3 41.59,60.04
+12V
  Top 0.406: U1.1 82.73,61.59 C12.+ 88.15,58.04 C14.2 92.24,56.49 D3.C 92.98,55.76 F3.2
_L32
  Top 0.254: _R_32.2 67.03,49.43 _L_32.K
A0  (via drill 0.35)
  Top 0.254: R10.1 43.82,60.35 Q2.E 43.82,55.17 49.61,55.17 v50.16,54.61 | v52.31,51.99 53.44,53.12 IC_1.23
  Bottom 0.254: v50.16,54.61 49.05,53.5 49.05,53.1 50.16,51.99 v52.31,51.99
A3  (via drill 0.35)
  Top 0.152: 56.91,52.65 IC_1.26
  Top 0.254: IC_1.26 57.39,52.17 v57.39,52.15 | _D25.A 18.63,48.58 | _D30.A 93.13,48.58 81.36,48.58 | 18.63,48.58 30.48,48.58 | 30.48,48.58 43.26,48.58 | 43.26,48.58 55.96,48.58 | 55.96,48.58 v57.39,48.58 68.5,48.58 | 68.5,48.58 81.36,48.58 | _D29.A 81.28,48.5 81.36,48.58 | _D28.A 68.5,47.81 68.5,48.58 | _D32.A 55.88,48.5 55.96,48.58 | _D27.A 43.18,48.5 43.26,48.58 | _D26.A 30.48,48.58 | _D24.A 18.63,50.05 18.63,48.58
  Bottom 0.254: v57.39,52.15 v57.39,48.58
A4  (via drill 0.35)
  Top 0.254: L_24.A 17.09,46.83 28.89,46.83 | L_30.A 104.2,46.83 92.47,46.83 | 54.29,46.83 41.59,46.83 L_26.A 38.55,47.73 38.1,48.17 32.37,48.17 31.03,46.83 28.89,46.83 | 54.29,46.83 v58.1,46.83 66.99,46.83 | 66.99,46.83 79.69,46.83 | 79.69,46.83 92.47,46.83 | L_29.A 92.39,46.91 92.47,46.83 | L_28.A 79.69,46.83 | _L_32.A 66.99,46.83 | L_27.A 54.29,46.83 | L_25.A 28.89,46.83 | IC_1.27 58.1,52.6 v58.1,50.32
  Bottom 0.254: v58.1,50.32 v58.1,46.83
A5  (via drill 0.35)
  Top 0.254: IC2.14 21.27,59.85 22.34,58.78 23.11,58.78 25.03,56.86 32.99,56.86 33.8,57.67 39.03,57.67 40.51,56.2 40.51,55.34 41.28,54.56 v48.77,54.56 | v53.82,55.32 56.5,55.32 IC_1.28
  Bottom 0.254: v53.82,55.32 50.03,55.32 49.27,54.56 v48.77,54.56
CARDPIN2  (via drill 0.35)
  Top 0.254: v13.65,57.07 IC4.6
  Bottom 0.254: U$8.2 16.68,54.04 v13.65,57.07
CARDPIN3  (via drill 0.35)
  Top 0.254: v11.11,57.15 IC4.4
  Bottom 0.254: U$8.3 15.58,44.59 11.75,48.42 11.75,56.52 v11.11,57.15
CARDPIN5  (via drill 0.35)
  Top 0.254: IC4.2 8.57,54.69 7.03,53.15 6.18,53.15 5.83,52.8 5.83,52.3 6.65,51.48 7.66,51.48 v14.13,45.01
  Bottom 0.254: v14.13,45.01 13.38,44.26 U$8.5
D2  (via drill 0.35)
  Top 0.254: IC_1.32 61.1,56.53 v61.12,56.52 | 30.48,23.18 28.26,23.18 27.41,22.33 _D10.A 17.7,22.59 18.53,23.41 18.53,24.64 17.7,25.47 _D9.A | 30.48,23.18 43.18,23.18 | 43.18,23.18 55.88,23.18 | 55.88,23.18 v61.12,23.18 68.5,23.18 | 68.5,23.18 81.28,23.18 | 81.28,23.18 93.13,23.18 _D16.A | _D15.A 81.28,23.18 | _D14.A 68.58,23.1 68.5,23.18 | _D13.A 55.88,23.18 | _D12.A 43.18,23.18 | _D11.A 30.48,23.18
  Bottom 0.254: v61.12,56.52 v61.12,23.18
D3  (via drill 0.35)
  Top 0.254: IC_1.1 58.9,57.48 v58.9,57.47 | L_9.A 17.09,21.43 28.89,21.43 | L_16.A 104.2,21.43 92.39,21.43 | 28.89,21.43 41.59,21.43 | 41.59,21.43 54.29,21.43 | 54.29,21.43 v58.9,21.43 66.99,21.43 | 66.99,21.43 79.69,21.43 | 79.69,21.43 92.39,21.43 | L_15.A 92.39,21.43 | L_14.A 79.69,21.43 | L_13.A 66.99,21.43 | L_12.A 54.29,21.43 | L_11.A 41.59,21.43 | L_10.A 28.89,21.43
  Bottom 0.254: v58.9,57.47 v58.9,21.43
D4  (via drill 0.35)
  Top 0.152: _D31.A 56.22,35.03
  Top 0.254: 59.28,58.96 IC_1.2 59.91,59.61 60.33,59.61 62.23,57.71 v62.23,56.52 | _D18.A 18.63,35.88 | _D23.A 93.13,35.88 81.28,35.88 | 18.63,35.88 30.48,35.88 | 30.48,35.88 43.18,35.88 | 43.18,35.88 55.88,35.88 | 55.88,35.88 v62.23,35.88 68.58,35.88 | 68.58,35.88 81.28,35.88 | _D22.A 81.28,35.88 | _D21.A 68.58,35.88 | _D31.A 55.88,35.88 | _D20.A 43.18,35.88 | _D19.A 30.48,35.88 | _D17.A 18.63,37.35 18.63,35.88
  Bottom 0.254: v62.23,56.52 v62.23,35.88
D5  (via drill 0.35)
  Top 0.254: IC_1.9 54.69,61.66 54.69,59.75 56.01,58.43 56.01,57.93 55.65,57.58 55.2,57.58 v54.69,57.07 | L_17.A 17.09,34.13 28.89,34.13 | L_23.A 104.2,34.13 92.39,34.13 | 28.89,34.13 41.59,34.13 | 41.59,34.13 v53.42,34.13 54.29,34.13 | 54.29,34.13 66.99,34.13 | 66.99,34.13 79.69,34.13 | 79.69,34.13 92.39,34.13 | L_22.A 92.39,34.13 | L_21.A 79.69,34.13 | _L_31.A 66.99,34.13 | L_20.A 54.29,34.13 | L_19.A 41.59,34.13 | L_18.A 28.89,34.13
  Bottom 0.254: v54.69,57.07 54.43,56.81 54.43,54.91 53.44,53.93 53.44,34.16 v53.42,34.13
D6  (via drill 0.35)
  Top 0.254: v55.4,58.18 54.05,59.53 54.05,61.18 IC_1.10 | L_1.A 16.19,8.73 28.89,8.73 | 28.89,8.73 41.59,8.73 | 41.59,8.73 54.29,8.73 | 55.05,8.73 66.99,8.73 | 66.99,8.73 79.69,8.73 | 79.69,8.73 92.39,8.73 | 92.39,8.73 104.2,8.73 L_8.A | L_7.A 92.39,8.73 | L_6.A 79.69,8.73 | L_5.A 66.99,8.73 | L_4.A 54.29,8.73 | L_3.A 41.59,8.73 | L_2.A 28.89,8.73 | 54.29,8.73 55.05,8.73 | 55.05,8.73 v55.07,8.71
  Bottom 0.254: v55.4,58.18 55.4,9.05 v55.07,8.71
D7  (via drill 0.35)
  Top 0.254: IC_1.11 52.01,62.07 v51.99,62.07 | v61.52,60.48 63.18,58.82 v63.18,56.52 | _D2.A 18.63,10.48 | _D8.A 93.13,10.48 81.28,10.48 | 18.63,10.48 30.48,10.48 | 30.48,10.48 43.18,10.48 | 43.18,10.48 55.88,10.48 | 55.88,10.48 v63.18,10.48 68.58,10.48 | 68.58,10.48 81.28,10.48 | _D7.A 81.28,10.48 | _D6.A 68.58,10.48 | _D5.A 55.88,10.48 | _D4.A 43.18,10.48 | _D3.A 30.48,10.48 | 18.63,10.48 18.63,11.95 _D1.A
  Bottom 0.254: v51.99,62.07 59.93,62.07 v61.52,60.48 | v63.18,56.52 v63.18,10.48
D8  (via drill 0.35)
  Top 0.152: IC2.11 25.16,61.13 | IC3.11 36.51,61.44
  Top 0.254: IC2.11 25.08,59.21 26.75,57.55 33.11,57.55 33.64,58.08 34.5,58.08 36.51,60.09 IC3.11 36.51,62.31 v36.91,62.71 | v49.53,63.42 52.29,60.66 IC_1.12
  Bottom 0.254: v36.91,62.71 48.82,62.71 v49.53,63.42
D9  (via drill 0.35)
  Top 0.152: 51.59,60.09 IC_1.13
  Top 0.254: IC2.12 23.81,62.31 24.69,63.18 27.78,63.18 29.56,61.4 29.56,58.81 29.91,58.45 30.75,58.45 32.01,59.71 32.01,61.85 32.29,62.13 35.24,62.13 | IC3.12 35.24,62.13 | 35.24,62.13 36.53,63.42 v46.36,63.42 | v48.42,63.42 51.73,60.11 IC_1.13
  Bottom 0.254: v46.36,63.42 v48.42,63.42
D10  (via drill 0.35)
  Top 0.203: 7.85,56.75 7.85,54.88 7.58,54.61 R31.1 | 14.92,56.83 IC4.7
  Top 0.254: IC4.7 14.92,58.02 | 14.92,58.02 14.92,59.56 15.5,60.14 15.5,63.12 v15.56,63.18 | 7.85,56.75 7.85,57.78 8.1,58.02 14.92,58.02 | IC_1.14 48.79,61.91 v48.74,61.91
  Bottom 0.254: v15.56,63.18 16.83,61.91 40.8,61.91 41.16,62.28 42.02,62.28 42.39,61.91 v48.74,61.91
D11  (via drill 0.35)
  Top 0.254: IC4.5 12.38,54.61 12.86,54.13 15.56,54.13 15.95,54.53 v28.42,54.53 | U$15.P$4 42,44.6 40.53,44.6 38.3,46.83 v33.34,46.83 | v50.96,57.55 51.2,57.78 51.2,58.36 IC_1.15
  Bottom 0.254: v28.42,54.53 33.34,49.61 v33.34,46.83 | U$15.P$4 43.5,44.17 42.4,45.27 42.4,46.24 41.77,46.87 41.77,50.7 44.15,53.09 44.15,54.21 46.33,56.39 49.7,56.39 50.86,57.55 v50.96,57.55
D12  (via drill 0.35)
  Top 0.254: v11.19,43.5 16.67,43.5 20.05,40.12 20.05,38.94 21.44,37.54 v27.46,37.54 | v32.7,47.55 38.16,47.55 38.38,47.32 39.27,47.32 U$15.P$1 | v48.97,58.26 49.9,58.26 IC_1.16
  Bottom 0.254: U$8.7 11.18,43.49 v11.19,43.5 | v27.46,37.54 29.56,39.64 31.23,39.64 32.7,41.12 v32.7,47.55 | U$15.P$1 40.96,51.03 43.35,53.42 43.35,55.72 45.89,58.26 v48.97,58.26
D13  (via drill 0.35)
  Top 0.254: IC4.3 9.84,54.61 10.79,53.66 16.51,53.66 16.98,54.13 26.76,54.13 v27.62,53.26 | v32.07,46.83 32.49,46.83 33.09,46.23 38.33,46.23 40.24,44.31 40.24,43.81 U$15.P$3 | v49.45,56.99 49.91,56.53 IC_1.17
  Bottom 0.254: U$15.P$3 40.96,44.17 42,45.21 42,46.07 41.36,46.71 41.36,50.87 43.75,53.25 43.75,55.55 45.37,57.18 49.26,57.18 v49.45,56.99 | v27.62,53.26 32.07,48.82 v32.07,46.83
GND  (via drill 0.3)
  Top 0.254: v50.8,53.98 51.17,53.98 51.27,53.87 51.9,53.87 IC_1.21
  Top 0.406: U3.2 3.49,52.25 C11.2 | v57.15,57.31 57.15,58 57.41,58.26 57.46,58.26 58.02,58.83 58.02,58.88 IC_1.3
  other vias: 62.23,58.82 22.38,62.94 33.42,63.02 34.69,59.77 48.9,52.15 26.59,49.53 28.97,56.04 27.62,51.28 29.45,52.47 30.64,53.82 53.26,56.04 46.75,55.8 45.09,53.66 44.69,51.75 47.86,47.78 52.31,49.85 9.13,54.21 15.72,52.86 13.02,49.29 17.78,44.53 15.88,45.24 14.37,44.13 11.03,44.77 16.11,57.39 60.72,58.26 56.75,59.53 53.98,58.42 65.01,50.48 75.64,50.01 44.21,28.5 49.29,30 49.13,22.38 39.05,22.38 50.24,24.45 39.37,25 37.15,24.69 34.61,34.85 50.16,37.54 75.96,37.31 88.42,37.31 101.28,36.67 101.28,23.57 89.46,25.08 77.07,25 64.53,25.16 64.53,22.23 75.88,22.38 88.27,22.46 102.39,11.03 98.9,13.26 90.41,12.46 90.01,9.76 78.34,12.14 77.79,9.84 65.33,12.62 59.53,9.6 48.9,11.11 52.55,12.94 45.56,9.6 37.62,11.91 36.59,9.6 24.29,9.68 21.35,34.92 23.26,41.35 23.73,38.73 64.93,38.02 65.17,35.08 49.61,35 39.61,37.47 86.52,35 75.49,35.08 100.25,48.74 89.69,49.85 88.66,47.7 72.71,47.7 65.33,47.78 68.02,54.05 99.38,56.2 94.93,58.02 91.52,58.1 65.09,57.23 60.25,53.58 59.93,50.48 60.09,47.62 54.69,53.98 56.12,54.61 39.53,51.99 19.45,47.78 19.37,49.45 25.48,57.71 26.99,62.55 12.78,62.87 3.18,57.78 1.43,51.67 39.61,35
  pour Bottom: -0.63,65.09 109.86,65.17 109.78,-0.48 -2.54,0 -0.63,60.33
  pour Top: -1.11,65.09 112.39,65.64 110.97,-1.19 -0.63,-1.27 -1.27,44.13
L32
  Top 0.254: R_31.2 _L_31.K
M_0_0  (via drill 0.35)
  Top 0.254: v20.8,58.26 20,59.05 IC2.15
  Bottom 0.254: JP4.1 26.49,45.36 20.8,51.05 v20.8,58.26
M_0_1  (via drill 0.35)
  Top 0.254: IC2.1 v18.73,57.15
  Bottom 0.254: v18.73,57.15 19.61,56.28 19.61,51.67 JP4.3
M_0_2  (via drill 0.35)
  Top 0.254: v20,57.86 IC2.2 | v20,46.12 21.91,46.12 27.38,40.64 JP4.5
  Bottom 0.254: v20,46.12 17.7,48.42 17.7,57.15 18.41,57.86 v20,57.86
M_0_3  (via drill 0.35)
  Top 0.254: 21.27,55.24 21.27,55.72 IC2.3 21.27,56.67 21.75,57.15 v22.3,57.15
  Bottom 0.254: JP4.4 29.7,44.12 29.7,45.96 28.86,46.81 26.71,46.81 22.3,51.21 v22.3,57.15
M_0_4  (via drill 0.35)
  Top 0.254: IC2.4 22.54,56.2 23.1,56.75 23.1,57.31 v22.23,58.18
  Bottom 0.254: JP4.6 29.3,42.14 29.3,45.79 28.69,46.4 26.02,46.4 21.65,50.78 21.65,57.6 v22.23,58.18
M_0_5  (via drill 0.35)
  Top 0.254: v23.81,57.23 IC2.5
  Bottom 0.254: JP4.2 30.1,46.06 30.1,47.59 23.81,53.89 v23.81,57.23
M_1_0  (via drill 0.35)
  Top 0.254: IC3.15 31.43,59.98 v31.19,59.75 | 8.23,19.2 8.23,14.45 9.3,13.38 14.34,13.38 15.39,14.42 R1.1 | 8.23,31.9 8.23,27.15 10.94,27.15 12.01,28.23 15.09,28.23 R_9.1 | 8.23,44.6 8.23,39.85 10.94,39.85 12.01,40.93 15.09,40.93 R17.1 | R24.1 12.97,47.81 8.23,52.55 8.22,52.55 v6.43,52.55
  Bottom 0.254: v31.19,59.75 7.04,59.75 6.43,59.13 v6.43,52.55
M_1_1
  Top 0.254: 20.93,19.2 20.93,14.45 23.64,14.45 24.71,15.53 27.71,15.53 R2.1 | 20.93,31.9 20.93,27.15 23.64,27.15 24.71,28.23 27.71,28.23 R_10.1 | 20.93,39.85 21.03,39.85 | 21.03,39.85 23.64,39.85 24.71,40.93 26.24,40.93 R18.1 | 20.93,44.6 20.93,39.96 21.03,39.85 | 20.93,52.55 23.64,52.55 24.71,53.63 26.24,53.63 27.71,52.16 | 27.71,52.16 R25.1 | IC3.1 30.16,54.61 27.71,52.16
M_1_2
  Top 0.254: 33.63,19.2 33.63,14.45 36.34,14.45 37.41,15.53 40.41,15.53 R3.1 | 33.63,31.9 33.63,27.15 36.34,27.15 37.41,28.23 40.41,28.23 R_11.1 | R19.1 38.94,40.93 37.41,40.93 36.34,39.85 33.63,39.85 33.63,44.6 | R26.1 40.74,51.83 40.74,52.47 39.58,53.63 37.41,53.63 36.34,52.55 33.63,52.55 32.71,52.55 32.7,52.55 31.43,53.82 IC3.2
M_1_3
  Top 0.254: 46.33,19.2 46.33,14.45 49.04,14.45 50.11,15.53 53.11,15.53 R4.1 | 46.33,31.9 46.33,27.15 49.04,27.15 50.11,28.23 53.11,28.23 R_12.1 | 46.33,39.85 46.43,39.85 | 46.43,39.85 49.04,39.85 50.11,40.93 53.11,40.93 R20.1 | 46.33,44.6 46.33,39.96 46.43,39.85 | IC3.3 32.7,54.53 33.2,54.03 39.75,54.03 41.23,52.55 46.33,52.55 47.92,50.96 R27.1
M_1_4  (via drill 0.35)
  Top 0.254: 59.03,19.2 59.03,14.45 61.74,14.45 62.81,15.53 65.81,15.53 R5.1 | R_13.1 65.81,28.23 62.81,28.23 61.74,27.15 59.03,27.15 59.03,31.9 56.2,31.9 55.15,32.96 45.61,32.96 42.1,29.45 v34.45,29.45 | R_31.1 65.81,40.93 62.81,40.93 61.74,39.85 59.03,39.85 59.03,44.6 | 59.03,52.55 61.74,52.55 62.81,53.63 64.34,53.63 _R_32.1 | IC3.4 v33.97,56.99
  Bottom 0.254: v33.97,56.99 33.97,29.92 v34.45,29.45
M_1_5  (via drill 0.35)
  Top 0.254: IC3.5 v35.24,57.07 | 71.73,19.2 71.73,14.45 | 71.73,14.45 74.44,14.45 75.51,15.53 78.51,15.53 R6.1 | 71.73,31.9 71.73,27.15 74.44,27.15 75.51,28.23 78.51,28.23 R_14.1 | 71.73,39.85 71.83,39.85 | 71.83,39.85 74.44,39.85 75.51,40.93 78.51,40.93 R21.1 | 71.73,44.6 71.73,39.96 71.83,39.85 | R28.1 79.12,51.55 77.8,51.55 77.64,51.72 77.64,52.93 76.94,53.63 75.51,53.63 74.44,52.55 71.73,52.55 | v43.89,12.7 v47.23,12.7 | 71.73,14.45 71.75,14.43 v71.75,13.18
  Bottom 0.254: v35.24,57.07 35.24,20 42.55,12.7 v43.89,12.7 | v47.23,12.7 49.03,12.7 54.74,6.99 65.98,6.99 67.84,8.86 67.84,9.26 v71.75,13.18
M_1_6  (via drill 0.35)
  Top 0.254: IC3.6 v36.51,57.07 | 97.13,14.45 97.13,19.2 | 97.13,14.45 99.84,14.45 100.91,15.53 103.91,15.53 R8.1 | 97.13,31.9 97.13,27.15 99.84,27.15 100.91,28.23 103.91,28.23 R16.1 | 97.13,39.85 97.23,39.85 | 97.23,39.85 99.84,39.85 100.91,40.93 103.91,40.93 R23.1 | 97.13,44.6 97.13,39.96 97.23,39.85 | 97.13,52.55 99.84,52.55 100.91,53.63 103.91,53.63 R30.1 | 97.13,14.45 97.13,12.17 v97.16,12.14
  Bottom 0.254: v36.51,57.07 36.51,21.75 51.67,6.59 93.42,6.59 97.16,10.32 v97.16,12.14
M_1_7  (via drill 0.35)
  Top 0.254: IC3.7 v37.78,57.07 | 84.43,19.2 84.43,14.45 | 84.43,14.45 87.14,14.45 88.21,15.53 91.21,15.53 R7.1 | 84.43,31.9 84.43,27.15 87.14,27.15 88.21,28.23 91.21,28.23 R15.1 | R22.1 91.21,40.93 88.21,40.93 87.14,39.85 84.43,39.85 84.43,44.6 | 84.43,52.55 87.14,52.55 88.21,53.63 89.74,53.63 R29.1 | 84.43,14.45 v83.11,14.45
  Bottom 0.254: v37.78,57.07 37.78,21.51 44.93,14.37 47.93,14.37 54.9,7.4 63.98,7.4 70.36,13.78 82.44,13.78 v83.11,14.45
N$1
  Top 0.254: 12.73,14.45 14.85,14.45 15.55,15.15 17.13,15.15 _D1.K
N$2
  Top 0.254: _D2.K 16.93,10.48 15.6,10.48 15.37,10.24 15.37,8.99 16.03,8.33 23.6,8.33 25.43,6.5
N$3
  Top 0.254: _D3.K 35,11.33 38.13,14.45
N$4
  Top 0.254: R9.2 47.14,58.88 Q2.B 44.75,59.85 44.75,61.07 44.59,61.23 43.36,61.23 42.94,60.82 42.94,57.87 JP5.1
N$5
  Top 0.254: _D4.K 47.7,11.33 50.83,14.45
N$8
  Top 0.254: _D5.K 60.4,11.33 63.53,14.45
N$9
  Top 0.254: _D6.K 73.1,11.33 76.23,14.45
N$10
  Top 0.254: R3.2 L_3.K 41.59,11.29
N$11
  Top 0.406: JP2.1 JP2.2 97,59.07 97,55.76 F3.3
N$12
  Top 0.254: 12.73,27.15 14.82,27.15 15.58,26.4 16.89,26.4 _D9.K
N$13
  Top 0.254: _D10.K 16.78,23.11 15.53,23.11 15.37,22.94 15.37,21.71 16.05,21.03 23.6,21.03 25.43,19.2
N$14
  Top 0.254: _D7.K 85.8,11.33 88.93,14.45
N$15
  Top 0.254: _D8.K 98.5,11.33 101.63,14.45
N$16
  Top 0.406: JP2.9 JP2.10
N$17
  Top 0.254: 38.13,27.15 35,24.03 _D11.K
N$21
  Top 0.254: R4.2 L_4.K 54.29,11.29
N$22
  Top 0.254: R5.2 L_5.K 66.99,11.29
N$23
  Top 0.254: R6.2 L_6.K 79.69,11.29
N$24
  Top 0.254: R7.2 L_7.K 92.39,11.29
N$25
  Top 0.254: 50.83,27.15 47.7,24.03 _D12.K
N$26
  Top 0.254: R8.2 L_8.K 105.09,11.29
N$27
  Top 0.254: 63.53,27.15 60.4,24.03 _D13.K
N$28
  Top 0.254: 76.23,27.15 73.1,24.03 _D14.K
N$29
  Top 0.254: 88.93,27.15 85.8,24.03 _D15.K
N$30
  Top 0.254: 101.63,27.15 98.5,24.03 _D16.K
N$31
  Top 0.254: 12.73,39.85 14.82,39.85 15.58,39.1 16.97,39.1 _D17.K
N$32
  Top 0.254: _D18.K 16.86,35.8 15.53,35.8 15.37,35.64 15.37,34.41 16.05,33.73 23.6,33.73 25.43,31.9
N$33
  Top 0.254: _D19.K 35,36.73 38.13,39.85
N$35
  Top 0.254: R1.2 L_1.K 16.19,11.29
N$36
  Top 0.254: R2.2 L_2.K 28.89,11.29
N$37
  Top 0.254: _D20.K 47.7,36.73 50.83,39.85
N$38
  Top 0.254: _D21.K 73.1,36.73 76.23,39.85
N$39
  Top 0.254: _D22.K 85.8,36.73 88.93,39.85
N$40
  Top 0.254: _D23.K 98.5,36.73 101.63,39.85
N$41
  Top 0.254: _D24.K 14.54,52.55 12.73,52.55
N$42
  Top 0.254: L_9.K R_9.2
N$43
  Top 0.254: L_10.K R_10.2
N$44
  Top 0.254: R_11.2 L_11.K
N$45
  Top 0.254: R_12.2 L_12.K
N$46
  Top 0.254: R_13.2 L_13.K
N$47
  Top 0.254: R_14.2 L_14.K
N$48
  Top 0.254: R15.2 L_15.K
N$51
  Top 0.254: R16.2 L_16.K
N$53
  Top 0.254: _D25.K 17.78,49.57 17.06,50.29 17.06,51.62 17.22,51.79 18.54,51.79 18.65,51.67 18.65,51.2 20.56,49.29 22.17,49.29 25.43,52.55
N$55
  Top 0.254: _D26.K 35,49.43 38.13,52.55
N$59
  Top 0.254: L_18.K 30.42,38.26 R18.2
N$60
  Top 0.254: L_19.K 43.12,38.26 R19.2
N$61
  Top 0.254: R17.2 L_17.K
N$62
  Top 0.254: R20.2 L_20.K
N$63
  Top 0.254: L_23.K R23.2
N$64
  Top 0.254: R22.2 L_22.K
N$65  (via drill 0.35)
  Top 0.254: _D27.K 50.22,49.43 v50.8,50.01 | v49.85,53.34 50.63,52.55 50.83,52.55
  Bottom 0.254: v50.8,50.01 52.18,51.39 52.56,51.39 52.91,51.74 52.91,52.24 52.56,52.59 50.59,52.59 v49.85,53.34
N$66
  Top 0.254: R21.2 L_21.K
N$68
  Top 0.254: _D28.K 73.1,49.43 76.23,52.55
N$69
  Top 0.254: _D29.K 85.8,49.43 88.93,52.55
N$70
  Top 0.254: _D30.K 98.5,49.43 101.63,52.55
N$71
  Top 0.254: _D31.K 60.4,36.73 63.53,39.85
N$72
  Top 0.254: _D32.K 60.4,49.43 63.53,52.55
N$80
  Top 0.254: IC2.9 27.62,59.85 29.42,58.05 30.92,58.05 32.7,59.83 IC3.14
N$82
  Top 0.254: R24.2 14.68,49.43 L_24.K
N$83
  Top 0.254: R25.2 28.93,49.43 L_25.K
N$84
  Top 0.254: L_26.K 43.12,50.96 R26.2
N$85
  Top 0.254: L_27.K 55.82,50.96 R27.2
N$86
  Top 0.254: L_28.K 79.73,49.43 R28.2
N$87
  Top 0.254: L_29.K 93.92,50.96 R29.2
N$88
  Top 0.254: R30.2 L_30.K
N$94
  Top 0.254: IC_1.7 57.01,62.39 57.39,62.39 57.68,62.1 57.68,62.08 59.12,60.64 59.37,60.64 59.97,61.24 U$14.1
N$95
  Top 0.254: IC_1.8 56.53,63.02 58.26,63.02 U$14.3
N$96
  Top 0.254: IC_1.30 59.53,54.55 59.53,54.53 66.64,54.53 73.75,61.64 73.75,62.5 73.14,63.11 71.46,63.11 JP12.4
N$97
  Top 0.254: JP12.5 65.88,55.24 59.99,55.24 IC_1.31
N$98  (via drill 0.35)
  Top 0.254: v48.42,58.98 47.15,60.25 C10.1 R32.2 | IC_1.29 56.93,56.04 54.21,56.04 v51.83,58.42
  Bottom 0.254: U$15.P$5 40.96,40.76 39.92,41.8 39.92,50.56 42.94,53.59 42.94,55.96 45.96,58.98 v48.42,58.98 50.48,58.98 51.04,58.42 v51.83,58.42
N$99  (via drill 0.35)
  Top 0.254: JP12.6 73.42,63.64 51.75,63.64 v51.05,62.94 v51.04,62.94 | v48.82,60.72 47.49,62.05 C10.2
  Bottom 0.254: v51.04,62.94 v48.82,60.72

### Text on the board
tPlace: knitt rider v1.0
bPlace: ptc | knitt rider v1.0